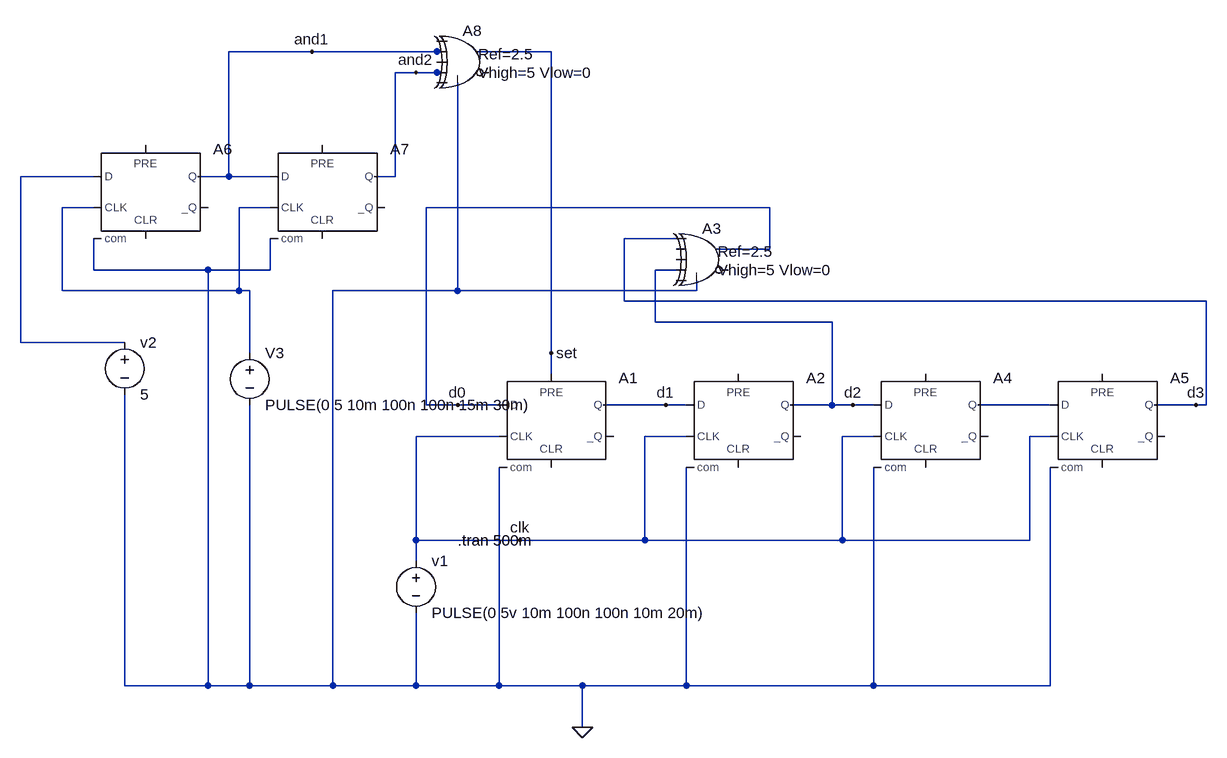
[diagram p0: schematic 4bitlfsr_final.asc]
4bitlfsr_final.asc, the LTspice schematic file:
Version 4
SHEET 1 1216 696
WIRE -336 -384 -464 -384
WIRE -144 -384 -336 -384
WIRE -128 -384 -144 -384
WIRE 32 -384 -80 -384
WIRE -176 -352 -208 -352
WIRE -144 -352 -176 -352
WIRE -128 -352 -144 -352
WIRE -672 -192 -784 -192
WIRE -464 -192 -464 -384
WIRE -464 -192 -512 -192
WIRE -400 -192 -464 -192
WIRE -208 -192 -208 -352
WIRE -208 -192 -240 -192
WIRE -672 -144 -720 -144
WIRE -400 -144 -448 -144
WIRE 368 -144 -160 -144
WIRE 224 -96 144 -96
WIRE 368 -80 368 -144
WIRE 368 -80 288 -80
WIRE -672 -48 -672 -96
WIRE -496 -48 -672 -48
WIRE -400 -48 -400 -96
WIRE -400 -48 -496 -48
WIRE 224 -48 192 -48
WIRE -720 -16 -720 -144
WIRE -448 -16 -448 -144
WIRE -448 -16 -720 -16
WIRE -432 -16 -448 -16
WIRE -112 -16 -112 -336
WIRE -112 -16 -304 -16
WIRE 256 -16 256 -32
WIRE 256 -16 -112 -16
WIRE 144 0 144 -96
WIRE 1040 0 144 0
WIRE 192 32 192 -48
WIRE 464 32 192 32
WIRE -784 64 -784 -192
WIRE -624 64 -784 64
WIRE -432 80 -432 -16
WIRE 32 80 32 -384
WIRE 32 112 32 80
WIRE -160 160 -160 -144
WIRE -112 160 -160 160
WIRE -48 160 -112 160
WIRE 208 160 112 160
WIRE 240 160 208 160
WIRE 464 160 464 32
WIRE 464 160 400 160
WIRE 496 160 464 160
WIRE 528 160 496 160
WIRE 800 160 688 160
WIRE 1024 160 960 160
WIRE 1040 160 1040 0
WIRE 1040 160 1024 160
WIRE -48 208 -176 208
WIRE 240 208 176 208
WIRE 528 208 480 208
WIRE 800 208 768 208
WIRE -176 368 -176 208
WIRE -16 368 -176 368
WIRE 176 368 176 208
WIRE 176 368 -16 368
WIRE 480 368 480 208
WIRE 480 368 176 368
WIRE 768 368 768 208
WIRE 768 368 480 368
WIRE -176 400 -176 368
WIRE -624 592 -624 144
WIRE -496 592 -496 -48
WIRE -496 592 -624 592
WIRE -432 592 -432 160
WIRE -432 592 -496 592
WIRE -304 592 -304 -16
WIRE -304 592 -432 592
WIRE -176 592 -176 480
WIRE -176 592 -304 592
WIRE -48 592 -48 256
WIRE -48 592 -176 592
WIRE 80 592 -48 592
WIRE 240 592 240 256
WIRE 240 592 80 592
WIRE 528 592 528 256
WIRE 528 592 240 592
WIRE 800 592 800 256
WIRE 800 592 528 592
WIRE 80 656 80 592
FLAG -112 160 d0
FLAG 208 160 d1
FLAG 496 160 d2
FLAG 1024 160 d3
FLAG 32 80 set
FLAG -16 368 clk
FLAG 80 656 0
FLAG -336 -384 and1
FLAG -176 -352 and2
SYMBOL Digital\\dflop 32 112 R0
WINDOW 3 8 12 Invisible 2
SYMATTR Value Ref=2.5
SYMATTR Value2 Vhigh=5 Vlow=0
SYMATTR SpiceLine Td=2n Trise=10n Tfall=10n
SYMATTR SpiceLine2 Tripdt=5n
SYMATTR InstName A1
SYMBOL Digital\\xor 272 -128 R0
WINDOW 3 16 52 Left 2
WINDOW 123 16 80 Left 2
SYMATTR Value Ref=2.5
SYMATTR Value2 Vhigh=5 Vlow=0
SYMATTR InstName A3
SYMBOL voltage -176 384 R0
WINDOW 123 0 0 Left 0
WINDOW 39 0 0 Left 0
SYMATTR InstName v1
SYMATTR Value PULSE(0 5v 10m 100n 100n 10m 20m)
SYMBOL voltage -624 48 R0
WINDOW 123 0 0 Left 0
WINDOW 39 0 0 Left 0
SYMATTR InstName v2
SYMATTR Value 5
SYMBOL Digital\\dflop -592 -240 R0
WINDOW 3 8 12 Invisible 2
SYMATTR Value Ref=2.5
SYMATTR Value2 Vhigh=5 Vlow=0
SYMATTR SpiceLine Td=2n Trise=10n Tfall=10n
SYMATTR SpiceLine2 tripdt=5n
SYMATTR InstName A6
SYMBOL Digital\\dflop -320 -240 R0
WINDOW 3 8 12 Invisible 2
SYMATTR Value Ref=2.5
SYMATTR Value2 Vhigh=5 Vlow=0
SYMATTR SpiceLine Td=2n Trise=10n Tfall=10n
SYMATTR SpiceLine2 Tripdt=5n
SYMATTR InstName A7
SYMBOL Digital\\dflop 320 112 R0
WINDOW 3 8 12 Invisible 2
SYMATTR Value Ref=2.5
SYMATTR InstName A2
SYMATTR Value2 Vhigh=5 Vlow=0
SYMATTR SpiceLine Td=2n Trise=10n Tfall=10n
SYMATTR SpiceLine2 Tripdt=5n
SYMBOL Digital\\dflop 608 112 R0
WINDOW 3 8 12 Invisible 2
SYMATTR Value Ref=2.5
SYMATTR Value2 Vhigh=5 Vlow=0
SYMATTR SpiceLine Td=2n Trise=10n Tfall=10n
SYMATTR SpiceLine2 Tripdt=5n
SYMATTR InstName A4
SYMBOL Digital\\dflop 880 112 R0
WINDOW 3 8 12 Invisible 2
SYMATTR Value Ref=2.5
SYMATTR Value2 Vhigh=5 Vlow=0
SYMATTR SpiceLine Td=2n Trise=10n Tfall=10n
SYMATTR SpiceLine2 Tripdt=5n
SYMATTR InstName A5
SYMBOL Digital\\xor -96 -432 R0
WINDOW 3 16 52 Left 2
WINDOW 123 16 80 Left 2
SYMATTR Value Ref=2.5
SYMATTR Value2 Vhigh=5 Vlow=0
SYMATTR InstName A8
SYMBOL voltage -432 64 R0
WINDOW 123 0 0 Left 0
WINDOW 39 0 0 Left 0
SYMATTR InstName V3
SYMATTR Value PULSE(0 5 10m 100n 100n 15m 30m)
TEXT -112 368 Left 2 !.tran 500m

The netlist it stands for:
* 4bitlfsr_final.asc
A1 d0 0 clk set 0 0 d1 0 DFLOP Ref=2.5 Vhigh=5 Vlow=0 Td=2n Trise=10n Tfall=10n Tripdt=5n
A3 d3 0 0 d2 0 0 d0 0 XOR Ref=2.5 Vhigh=5 Vlow=0
v1 clk 0 PULSE(0 5v 10m 100n 100n 10m 20m)
v2 N001 0 5
A6 N001 0 N002 0 0 0 and1 0 DFLOP Ref=2.5 Vhigh=5 Vlow=0 Td=2n Trise=10n Tfall=10n tripdt=5n
A7 and1 0 N002 0 0 0 and2 0 DFLOP Ref=2.5 Vhigh=5 Vlow=0 Td=2n Trise=10n Tfall=10n Tripdt=5n
A2 d1 0 clk 0 0 0 d2 0 DFLOP Ref=2.5 Vhigh=5 Vlow=0 Td=2n Trise=10n Tfall=10n Tripdt=5n
A4 d2 0 clk 0 0 0 N003 0 DFLOP Ref=2.5 Vhigh=5 Vlow=0 Td=2n Trise=10n Tfall=10n Tripdt=5n
A5 N003 0 clk 0 0 0 d3 0 DFLOP Ref=2.5 Vhigh=5 Vlow=0 Td=2n Trise=10n Tfall=10n Tripdt=5n
A8 0 and1 0 and2 0 0 set 0 XOR Ref=2.5 Vhigh=5 Vlow=0
V3 N002 0 PULSE(0 5 10m 100n 100n 15m 30m)
.tran 500m
.backanno
.end